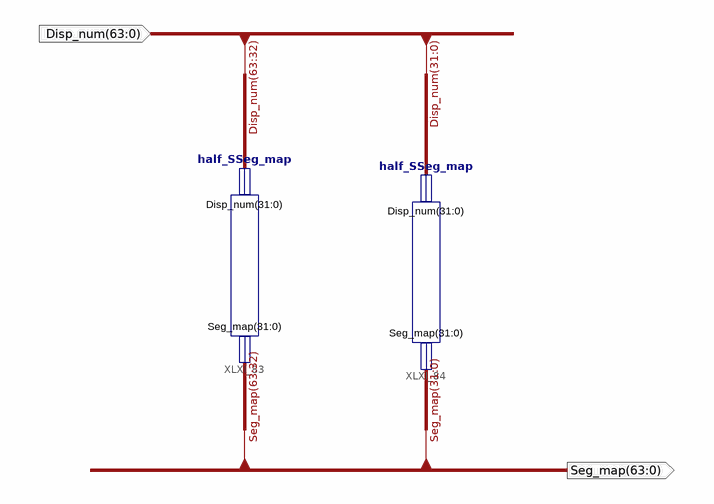
[diagram p0: schematic sheet 1]
// Xilinx ISE schematic SSeg_map.sch (kintex7) as structural Verilog: 2 symbols, 2 ports
module SSeg_map (
  input  [63:0] Disp_num,
  output [63:0] Seg_map
);

  half_SSeg_map XLXI_83 (.Disp_num(Disp_num[63:32]), .Seg_map(Seg_map[63:32]));
  half_SSeg_map XLXI_84 (.Disp_num(Disp_num[31:0]), .Seg_map(Seg_map[31:0]));
endmodule
